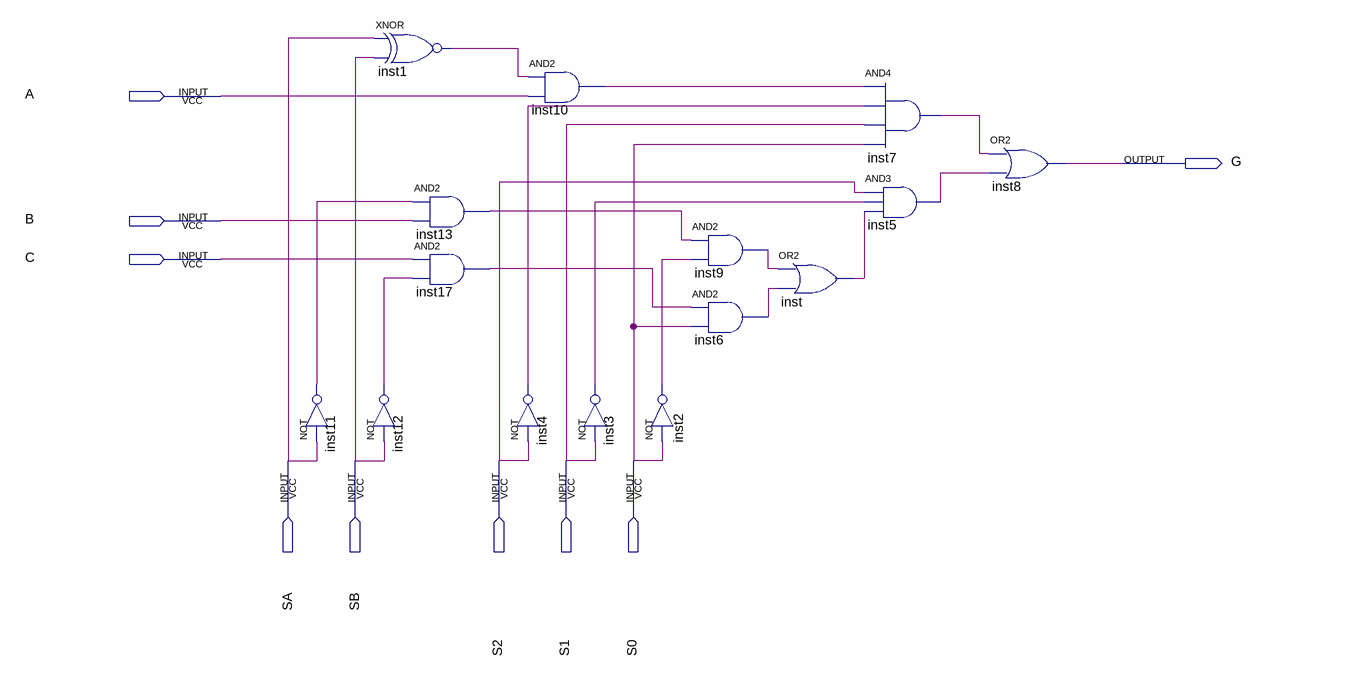
[diagram p0: schematic sheet]
// Quartus schematic DEC_S2.bdf as structural Verilog: 15 symbols, 9 pins
module DEC_S2 (
  input  A,
  input  B,
  input  C,
  input  SA,
  input  SB,
  input  S2,
  input  S1,
  input  S0,
  output G
);

  wire inst1_out, inst2_out, inst3_out, inst4_out, inst5_out, inst6_out, inst7_out, inst9_out, inst10_out,
       inst11_out, inst12_out, inst13_out, inst17_out, inst_out;

  not inst11 (inst11_out, SA);
  xnor inst1 (inst1_out, SA, SB);
  not inst12 (inst12_out, SB);
  and inst13 (inst13_out, inst11_out, B);
  and inst17 (inst17_out, C, inst12_out);
  and inst10 (inst10_out, inst1_out, A);
  not inst4 (inst4_out, S2);
  not inst3 (inst3_out, S1);
  and inst9 (inst9_out, inst13_out, inst2_out);
  and inst6 (inst6_out, inst17_out, S0);
  not inst2 (inst2_out, S0);
  or inst (inst_out, inst9_out, inst6_out);
  and inst7 (inst7_out, inst10_out, inst4_out, S1, S0);
  and inst5 (inst5_out, S2, inst3_out, inst_out);
  or inst8 (G, inst7_out, inst5_out);
endmodule
